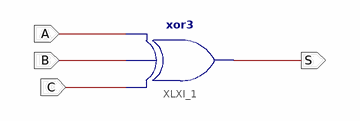
[diagram p0: schematic sheet 1]
// Xilinx ISE schematic XOR_bit.sch (spartan3) as structural Verilog: 1 symbols, 4 ports
module XOR_bit (
  input  A,
  input  B,
  input  C,
  output S
);

  xor XLXI_1 (S, C, B, A);
endmodule
